# Altium schematic sheet main.SchDoc
size A4
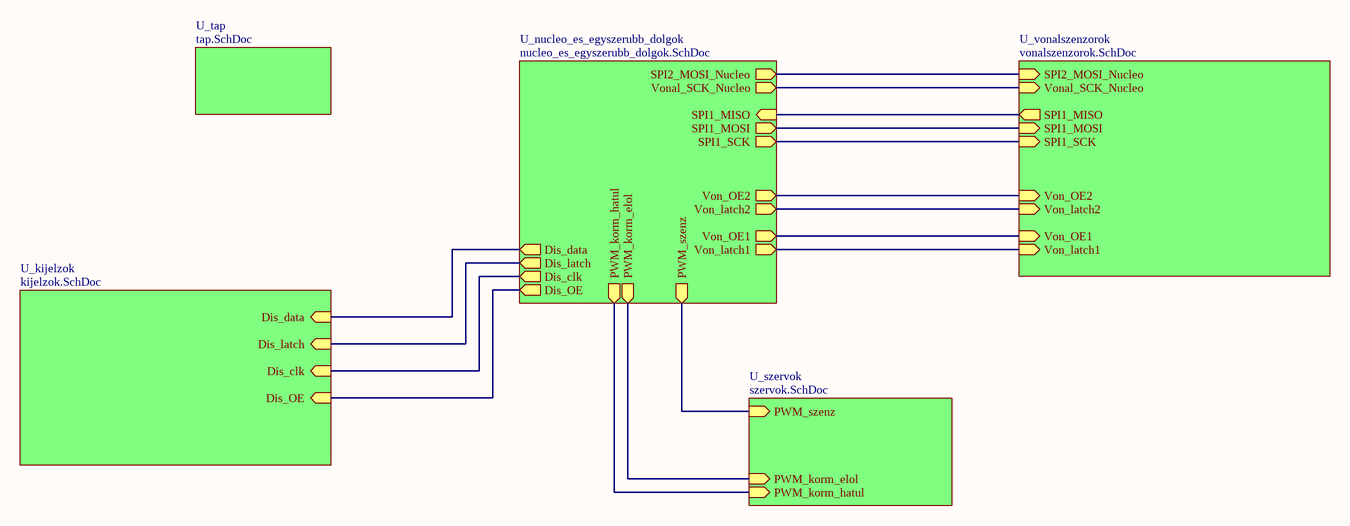
[diagram p0: main.SchDoc]

## Sub-sheets
U_kijelzok = kijelzok.SchDoc: Dis_OE (in), Dis_clk (in), Dis_data (in), Dis_latch (in)
U_nucleo_es_egyszerubb_dolgok = nucleo_es_egyszerubb_dolgok.SchDoc: SPI2_MOSI_Nucleo (out), Vonal_SCK_Nucleo (out), PWM_korm_hatul (out), PWM_korm_elol (out), SPI1_MOSI (out), SPI1_MISO (in), SPI1_SCK (out), Dis_latch (out), Dis_data (out), Dis_OE (out), Dis_clk (out), Von_latch2 (out), Von_OE2 (out), Von_OE1 (out), Von_latch1 (out), PWM_szenz (out)
U_szervok = szervok.SchDoc: PWM_szenz (in), PWM_korm_elol (in), PWM_korm_hatul (in)
U_tap = tap.SchDoc: no entries
U_vonalszenzorok = vonalszenzorok.SchDoc: SPI2_MOSI_Nucleo (in), Vonal_SCK_Nucleo (in), SPI1_MISO (out), SPI1_MOSI (in), SPI1_SCK (in), Von_OE1 (in), Von_latch2 (in), Von_OE2 (in), Von_latch1 (in)

## Nets
(unnamed): sheet U_kijelzok/Dis_OE, sheet U_nucleo_es_egyszerubb_dolgok/Dis_OE
(unnamed): sheet U_kijelzok/Dis_clk, sheet U_nucleo_es_egyszerubb_dolgok/Dis_clk
(unnamed): sheet U_kijelzok/Dis_data, sheet U_nucleo_es_egyszerubb_dolgok/Dis_data
(unnamed): sheet U_kijelzok/Dis_latch, sheet U_nucleo_es_egyszerubb_dolgok/Dis_latch
(unnamed): sheet U_nucleo_es_egyszerubb_dolgok/SPI2_MOSI_Nucleo, sheet U_vonalszenzorok/SPI2_MOSI_Nucleo
(unnamed): sheet U_nucleo_es_egyszerubb_dolgok/Vonal_SCK_Nucleo, sheet U_vonalszenzorok/Vonal_SCK_Nucleo
(unnamed): sheet U_nucleo_es_egyszerubb_dolgok/PWM_korm_hatul, sheet U_szervok/PWM_korm_hatul
(unnamed): sheet U_nucleo_es_egyszerubb_dolgok/PWM_korm_elol, sheet U_szervok/PWM_korm_elol
(unnamed): sheet U_nucleo_es_egyszerubb_dolgok/SPI1_MOSI, sheet U_vonalszenzorok/SPI1_MOSI
(unnamed): sheet U_nucleo_es_egyszerubb_dolgok/SPI1_MISO, sheet U_vonalszenzorok/SPI1_MISO
(unnamed): sheet U_nucleo_es_egyszerubb_dolgok/SPI1_SCK, sheet U_vonalszenzorok/SPI1_SCK
(unnamed): sheet U_nucleo_es_egyszerubb_dolgok/Von_latch2, sheet U_vonalszenzorok/Von_latch2
(unnamed): sheet U_nucleo_es_egyszerubb_dolgok/Von_OE2, sheet U_vonalszenzorok/Von_OE2
(unnamed): sheet U_nucleo_es_egyszerubb_dolgok/Von_OE1, sheet U_vonalszenzorok/Von_OE1
(unnamed): sheet U_nucleo_es_egyszerubb_dolgok/Von_latch1, sheet U_vonalszenzorok/Von_latch1
(unnamed): sheet U_nucleo_es_egyszerubb_dolgok/PWM_szenz, sheet U_szervok/PWM_szenz